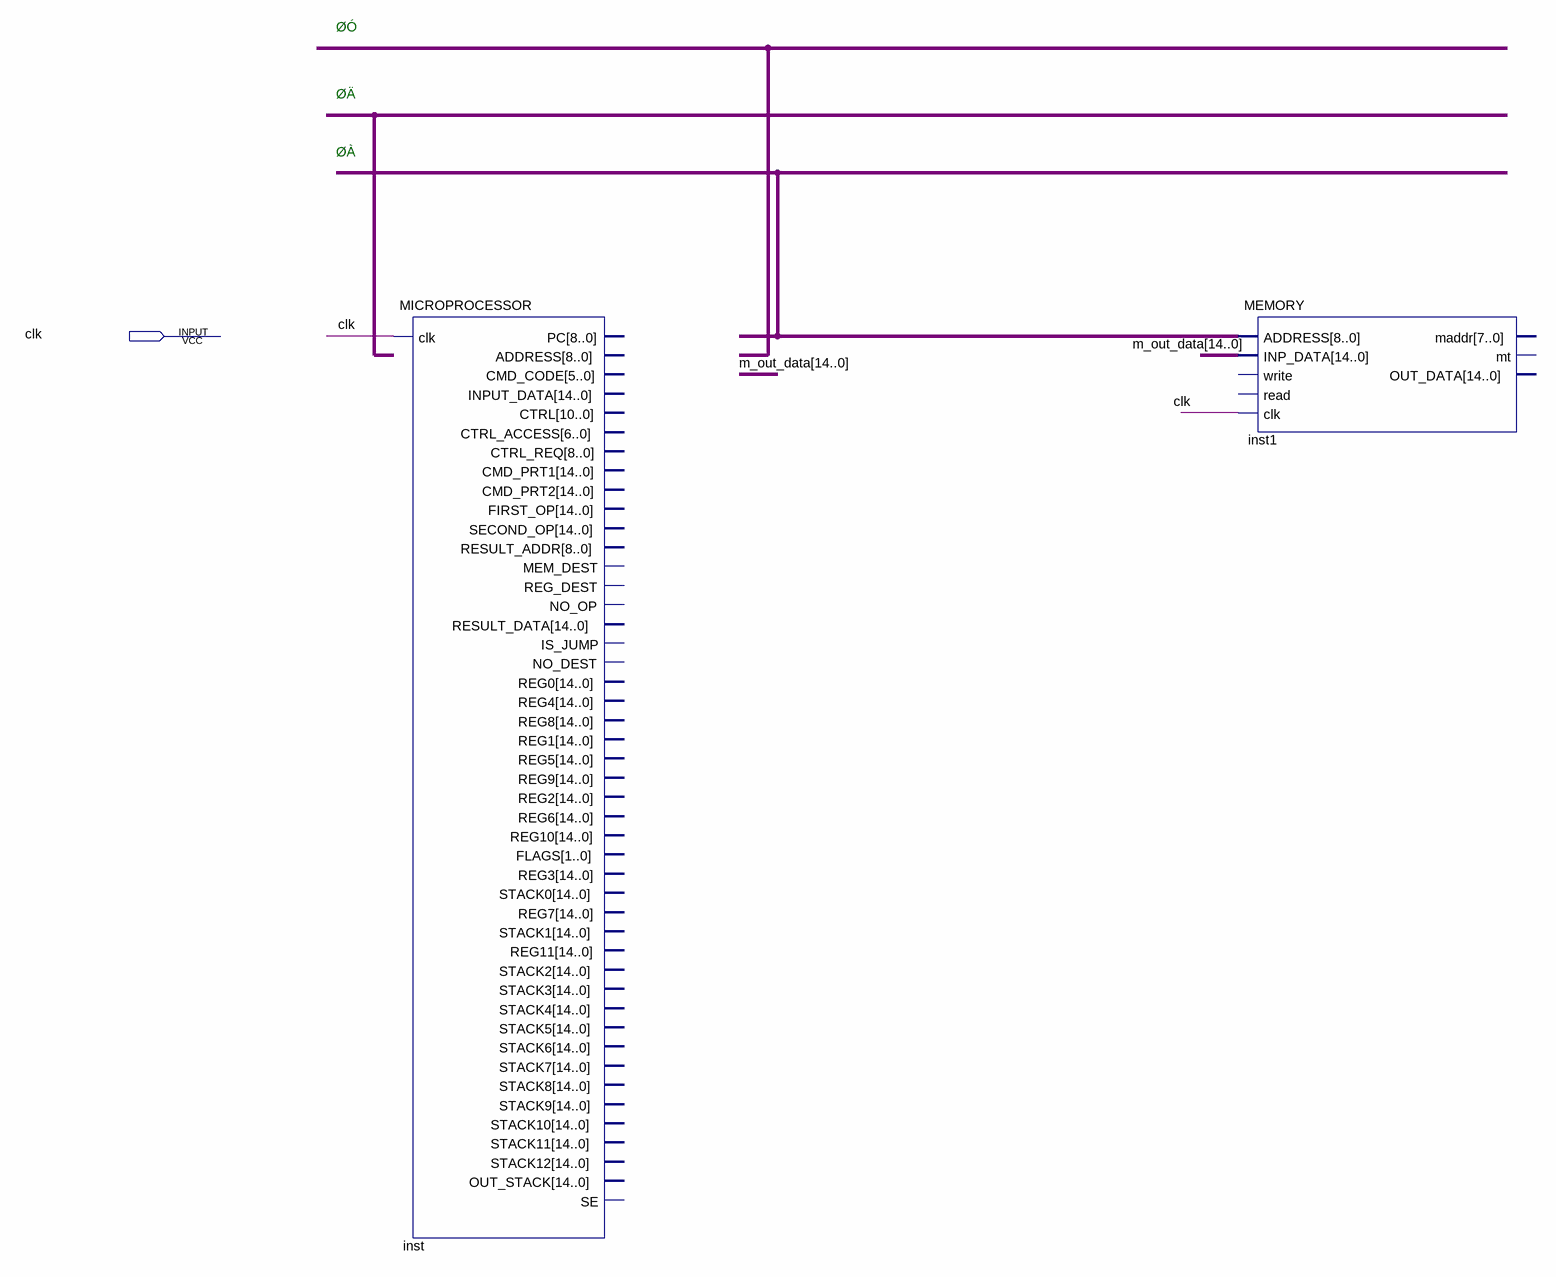
[diagram p0: schematic sheet]
// Quartus schematic MAIN.bdf as structural Verilog: 2 symbols, 1 pins
module MAIN (
  input  clk
);

  wire [8:0] undriven;
  wire [14:0] m_out_data;

  MICROPROCESSOR inst (.clk(clk));  // open: PC, ADDRESS, CMD_CODE, INPUT_DATA, CTRL, CTRL_ACCESS, CTRL_REQ, CMD_PRT1, CMD_PRT2, FIRST_OP, SECOND_OP, RESULT_ADDR, MEM_DEST, REG_DEST, NO_OP, RESULT_DATA, IS_JUMP, NO_DEST, REG0, REG4, REG8, REG1, REG5, REG9, REG2, REG6, REG10, FLAGS, REG3, STACK0, REG7, STACK1, REG11, STACK2, STACK3, STACK4, STACK5, STACK6, STACK7, STACK8, STACK9, STACK10, STACK11, STACK12, OUT_STACK, SE
  MEMORY inst1 (.ADDRESS(undriven), .INP_DATA(m_out_data), .clk(clk));  // open: write, read, maddr, mt, OUT_DATA

  // Notes on the sheet:
  //   ØÓ
  //   ØÄ
  //   ØÀ
endmodule
